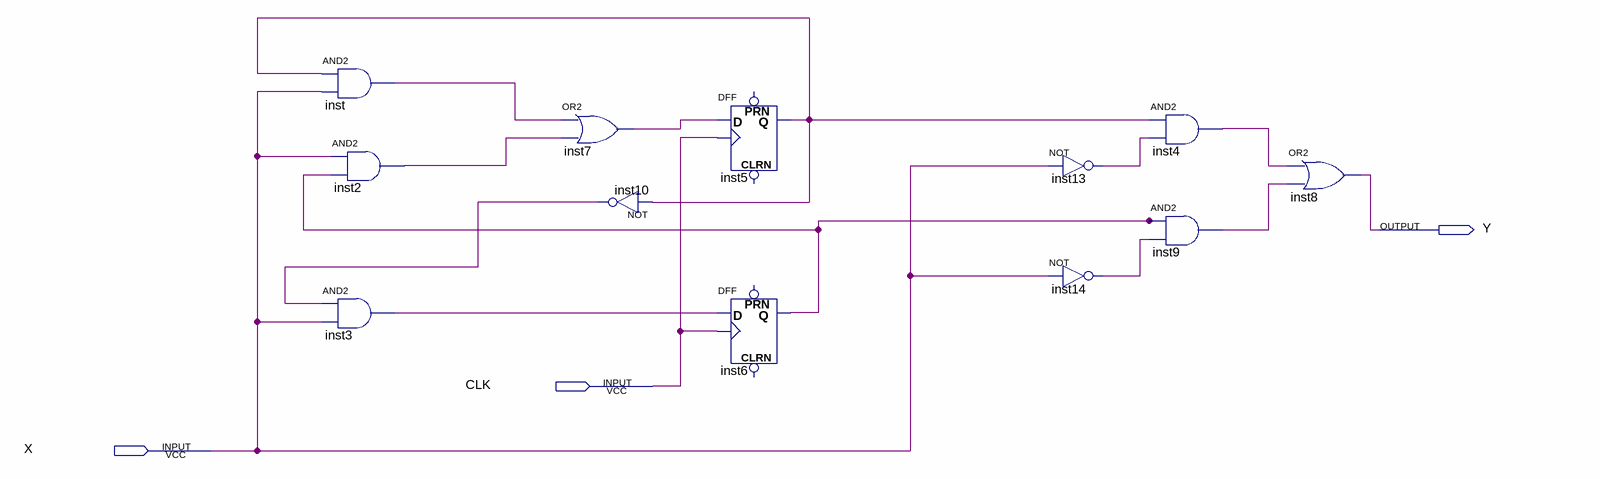
[diagram p0: schematic sheet]
// Quartus schematic demo.bdf as structural Verilog: 12 symbols, 3 pins
module demo (
  input  CLK,
  input  X,
  output Y
);

  wire inst2_out, inst3_out, inst4_out, inst5_q, inst6_q, inst7_out, inst9_out, inst10_out, inst13_out,
       inst14_out, inst_out;

  and inst (inst_out, inst5_q, X);
  and inst2 (inst2_out, X, inst6_q);
  and inst3 (inst3_out, inst10_out, X);
  or inst7 (inst7_out, inst_out, inst2_out);
  not inst10 (inst10_out, inst5_q);
  DFF inst5 (.CLK(CLK), .D(inst7_out), .Q(inst5_q));  // open: CLRN, PRN
  DFF inst6 (.CLK(CLK), .D(inst3_out), .Q(inst6_q));  // open: CLRN, PRN
  not inst13 (inst13_out, X);
  not inst14 (inst14_out, X);
  and inst4 (inst4_out, inst5_q, inst13_out);
  and inst9 (inst9_out, inst6_q, inst14_out);
  or inst8 (Y, inst4_out, inst9_out);
endmodule
